# EAGLE design rfid_ctl3 (EAGLE 7.5.0)
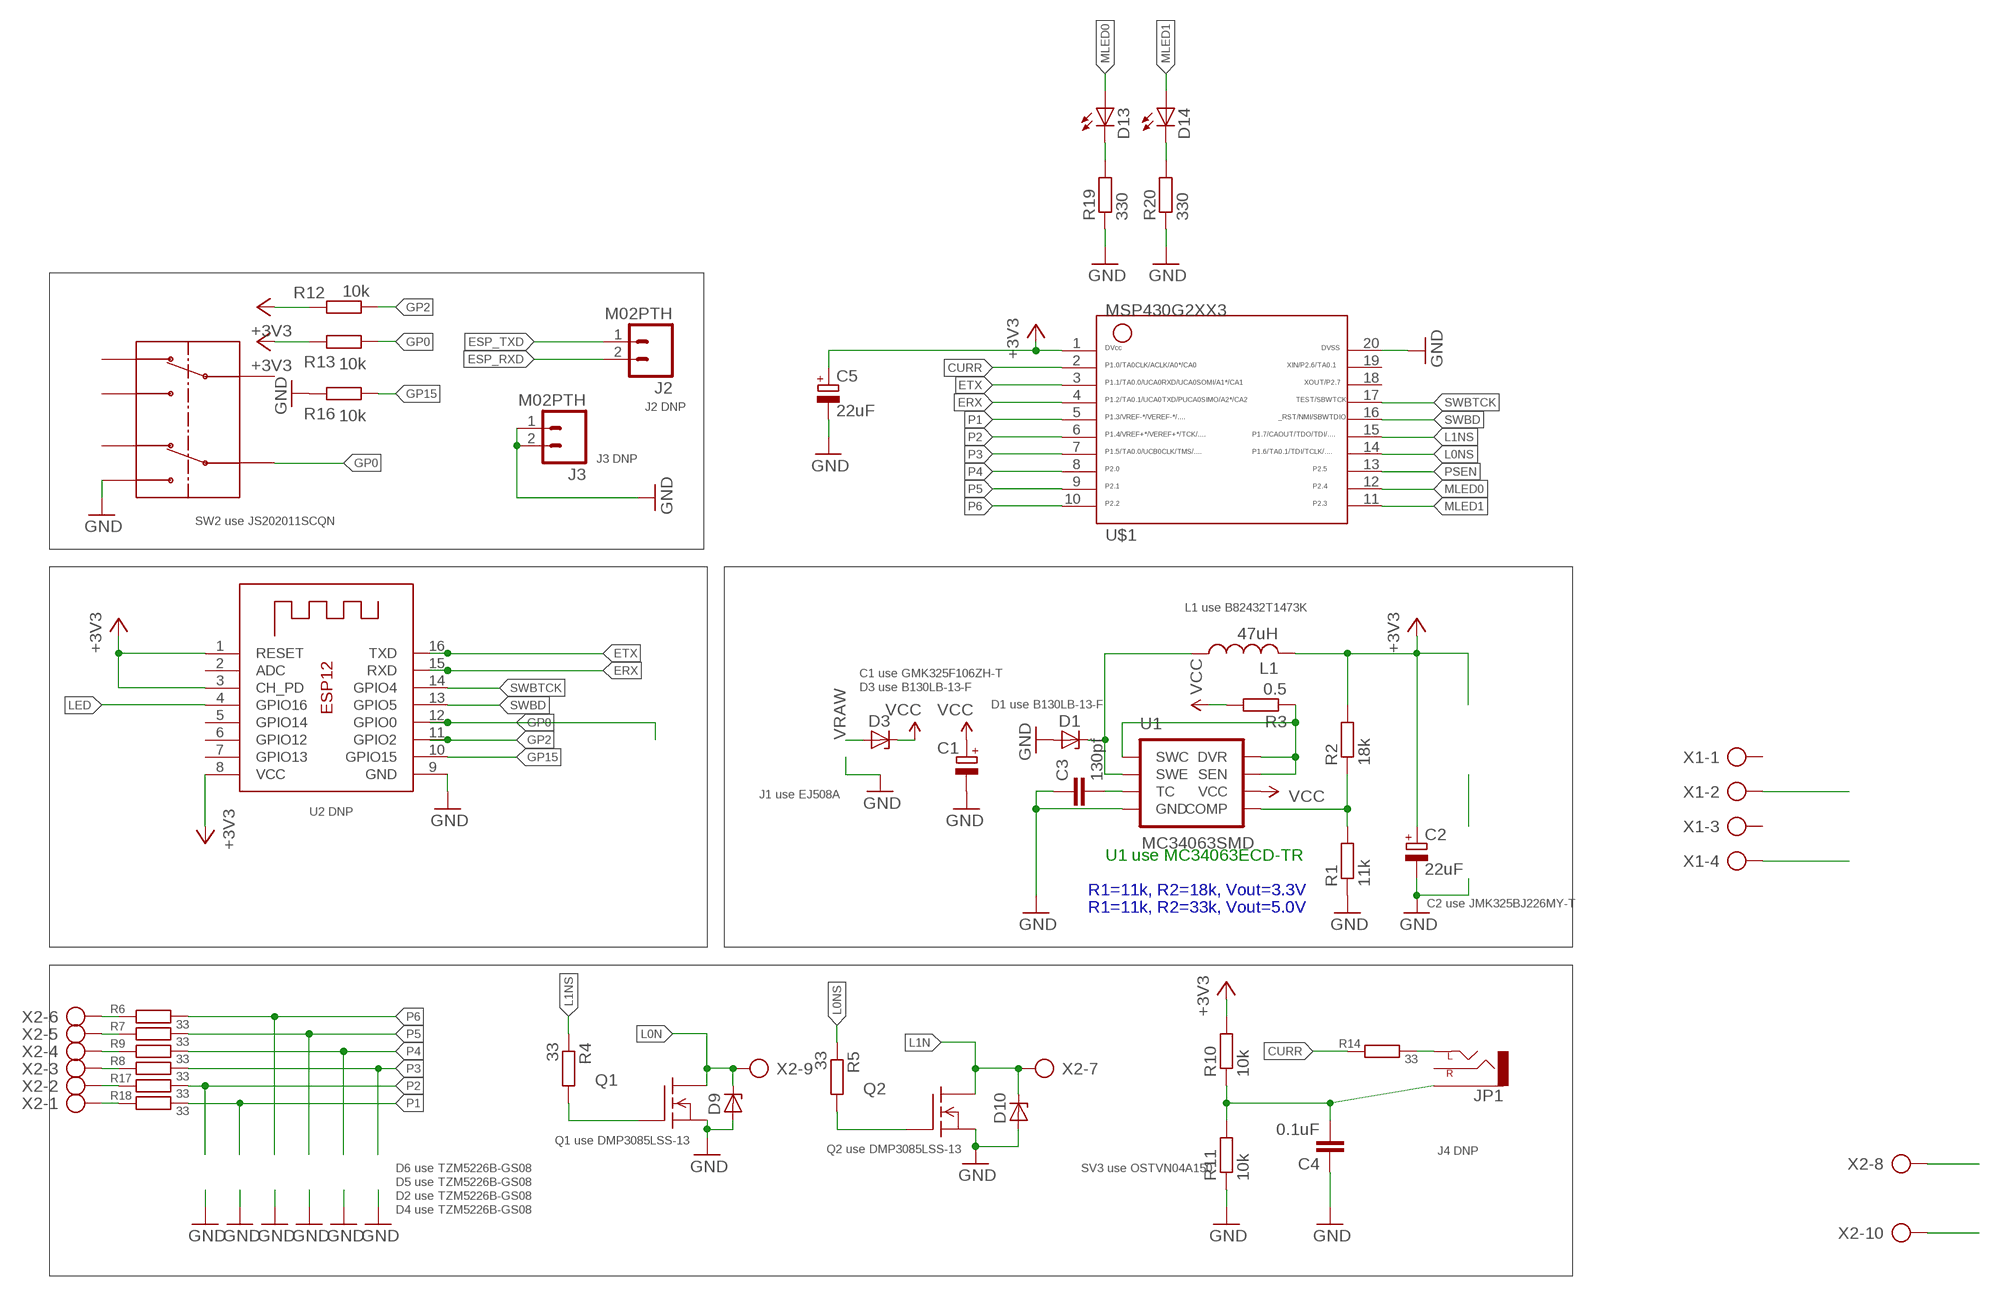
[diagram p0: schematic, sheet 1]

## Parts
C1  CPOL-EUE2.5-7  [E2,5-7]
C2  22uF  CPOL-EUE2.5-7  [E2,5-7]
C3  130pf  C-EUC1206  [C1206]
C4  0.1uF  C-EUC0603  [C0603]
C5  22uF  CPOL-EUE1.8-4  [E1,8-4]
D1  ZENER-DIODESMB  [SMB]
D3  ZENER-DIODESMB  [SMB]
D9  ZENER-DIODESMB  [SMB]
D10  ZENER-DIODESMB  [SMB]
D13  LED5MM  [LED5MM]
D14  LED5MM  [LED5MM]
J2  M02PTH  [1X02]
J3  M02PTH  [1X02]
JP1  AUDIO-JACKSMD2  [AUDIO-JACK-3.5MM-SMD]
L1  47uH  L-USL1812  [L1812]
Q1  FDS5680  [SO-8]
Q2  FDS5680  [SO-8]
R1  11k  R-EU_R1206  [R1206]
R2  18k  R-EU_R1206  [R1206]
R3  0.5  R-EU_R1206  [R1206]
R4  33  R-EU_R1206  [R1206]
R5  33  R-EU_R1206  [R1206]
R6  33  R-EU_R1206  [R1206]
R7  33  R-EU_R1206  [R1206]
R8  33  R-EU_R1206  [R1206]
R9  33  R-EU_R1206  [R1206]
R10  10k  R-EU_R0603  [R0603]
R11  10k  R-EU_R0603  [R0603]
R12  10k  R-EU_R1206  [R1206]
R13  10k  R-EU_R1206  [R1206]
R14  33  R-EU_R1206  [R1206]
R16  10k  R-EU_R0603  [R0603]
R17  33  R-EU_R1206  [R1206]
R18  33  R-EU_R1206  [R1206]
R19  330  R-EU_R0805  [R0805]
R20  330  R-EU_R0805  [R0805]
SW2  L202011MS02Q  [SMT]
U1  MC34063SMD  [SO08]
U2  ESP-12  [ESP-12]
U$1  G2XX3---N20  [N20]
X1  AK300/4  [AK300/4]
X2  AK300/10  [AK300/10]

## Nets
+3V3: C2.+ C5.+ L1.2 R2.2 R10.2 R12.2 R13.2 U2.1(RESET) U2.3(CH_PD) U2.8(VCC) U$1.1
CURR: R14.1 U$1.2
ERX: U2.15(RXD) U$1.4
ESP_RXD: J2.2
ESP_TXD: J2.1
ETX: U2.16(TXD) U$1.3
GND: C1.- C2.- C3.1 C4.1 C5.- D1.A D9.A D10.A J3.1 J3.2 Q1.1(S) Q1.2(S) Q1.3(S) Q2.1(S) Q2.2(S) Q2.3(S) R1.1 R11.1 R16.2 R19.1 R20.1 SW2.B1 U1.4(GND) U2.9(GND) U$1.20
GP0: R13.1 SW2.B U2.12(GPIO0)
GP2: R12.1 U2.11(GPIO2)
GP15: R16.1 U2.10(GPIO15)
L0N: D9.C Q1.5(D) Q1.6(D) Q1.7(D) Q1.8(D) X2.9
L0NS: R5.1 U$1.14
L1N: D10.C Q2.5(D) Q2.6(D) Q2.7(D) Q2.8(D) X2.7
L1NS: R4.1 U$1.15
LED: U2.4(GPIO16)
MLED0: D13.A U$1.12
MLED1: D14.A U$1.11
N$1: Q1.4(G) R4.2
N$2: C3.2 U1.3(TC)
N$3: D1.C L1.1 U1.2(SWE)
N$4: Q2.4(G) R5.2
N$5: R1.2 R2.1 U1.5(COMP)
N$6: R3.1 U1.1(SWC) U1.7(SEN) U1.8(DVR)
N$8: R6.1 X2.6
N$9: R7.1 X2.5
N$10: R8.1 X2.4
N$11: R9.1 X2.3
N$12: C4.2 JP1.SLEEVE R10.1 R11.2
N$14: JP1.TIP(LEFT) R14.2
N$15: D13.K(C) R19.2
N$16: D14.K(C) R20.2
N$17: R17.1 X2.2
N$18: R18.1 X2.1
P1: R18.2 U$1.5
P2: R17.2 U$1.6
P3: R9.2 U$1.7
P4: R8.2 U$1.8
P5: R7.2 U$1.9
P6: R6.2 U$1.10
PSEN: U$1.13
SWBD: U2.13(GPIO5) U$1.16
SWBTCK: U2.14(GPIO4) U$1.17
VCC: C1.+ D3.C R3.2 U1.6(VCC)
VRAW: D3.A X1.2 X1.4 X2.8 X2.10
Unconnected: JP1.RING(RIGHT) SW2.A SW2.A1 SW2.A2 SW2.B2 U2.2(ADC) U2.5(GPIO14) U2.6(GPIO12) U2.7(GPIO13) U$1.18 U$1.19 X1.1 X1.3

## Notes on the sheet
- J2 DNP
- J3 DNP
- SW2 use JS202011SCQN
- L1 use B82432T1473K
- C1 use GMK325F106ZH-T
- D3 use B130LB-13-F
- D1 use B130LB-13-F
- J1 use EJ508A
- U2 DNP
- U1 use MC34063ECD-TR
- R1=11k, R2=18k, Vout=3.3V
- C2 use JMK325BJ226MY-T
- R1=11k, R2=33k, Vout=5.0V
- Q1 use DMP3085LSS-13
- Q2 use DMP3085LSS-13 | J4 DNP
- D6 use TZM5226B-GS08 | SV3 use OSTVN04A150
- D5 use TZM5226B-GS08
- D2 use TZM5226B-GS08
- D4 use TZM5226B-GS08

## Library data of the parts
C1 C2 C5 = rcl:CPOL-EU: POLARIZED CAPACITOR, European symbol
C3 C4 = rcl:C-EU: CAPACITOR, European symbol
D1 D3 D9 D10 = diode:ZENER-DIODE: Z-Diode
D13 D14 = adafruit:LED: LED OSRAM: - CHIPLED LG R971, LG N971, LY N971, LG Q971, LY Q971, LO R971, LY R971 LH N974, LH R974 LS Q976, LO Q976, LY Q976 LO Q996 - Hyper CHIPLED LW Q18S LB Q993, LB Q99A, LB R99A - SideLED LS A670, LO A670, LY A670, LG A670, LP A670 LB A673, LV A673, LT A673, LW A673 LH A674 LY A675 LS A676, LA A676, LO A676, LY A676, LW A676 LS A679, LY A679, LG A679 - Hyper Micro SIDELED® LS Y876, LA Y876, LO Y876, LY Y876 LT Y87S - SmartLED LW L88C, LW L88S LB L89C, LB L89S, LG L890 LS L89K, LO L89K, LY L89K LS L896, LA L896, LO L896, LY L896 - TOPLED LS T670, LO T670, LY T670, LG T670, LP T670 LSG T670, LSP T670, LSY T670, LOP T670, LYG T670 LG T671, LOG T671, LSG T671 LB T673, LV T673, LT T673, LW T673 LH T674 LS T676, LA T676, LO T676, LY T676, LB T676, LH T676, LSB T676, LW T676 LB T67C, LV T67C, LT T67C, LS T67K, LO T67K, LY T67K, LW E67C LS E67B, LA E67B, LO E67B, LY E67B, LB E67C, LV E67C, LT E67C LW T67C LS T679, LY T679, LG T679 LS T770, LO T770, LY T770, LG T770, LP T770 LB T773, LV T773, LT T773, LW T773 LH T774 LS E675, LA E675, LY E675, LS T675 LS T776, LA T776, LO T776, LY T776, LB T776 LHGB T686 LT T68C, LB T68C - Hyper Mini TOPLED® LB M676 - Mini TOPLED Santana® LG M470 LS M47K, LO M47K, LY M47K Source: http://www.osram.convergy.de/
J2 J3 = SparkFun-Connectors:M02: Standard 2-pin 0.1" header. Use with - straight break away headers ( PRT-00116) - right angle break away headers (PRT-00553) - swiss pins (PRT-00743) - machine pins (PRT-00117) - female headers (PRT-00115) Molex polarized connector foot print use with: PRT-08233 with associated crimp pins and housings. 2.54_SCREWTERM for use with PRT-10571. 3.5mm Screw Terminal footprints for PRT-08084 5mm Screw Terminal footprints for use with PRT-08432
JP1 = SparkFun-Connectors:AUDIO-JACK: 3.5mm Audio Jack Simple 3.5mm common PCB mount audio jack. SKU: PRT-08032; PROD_ID: CONN-10353
L1 = rcl:L-US: INDUCTOR, American symbol
Q1 Q2 = transistor-fet:FDS5680: 60V N-Channel PowerTrench TM MOSFET FAIRCHILD FDS5680.pdf
R1-R14 R16-R20 = rcl:R-EU_: RESISTOR, European symbol
SW2 = JS202011SCQNC&K:L202011MS02Q
U1 = SparkFun:MC34063
U2 = adafruit:ESP-12
U$1 = TI_MSP430_v16:G2XX3---N20: MSP430G2XX1 PDIP (N) 20 Pin Package
X1 = con-ptr500:AK300/4: CONNECTOR; OC_FARNELL: unknown; OC_NEWARK: unknown
X2 = con-ptr500:AK300/10: CONNECTOR; OC_FARNELL: unknown; OC_NEWARK: unknown

## Board
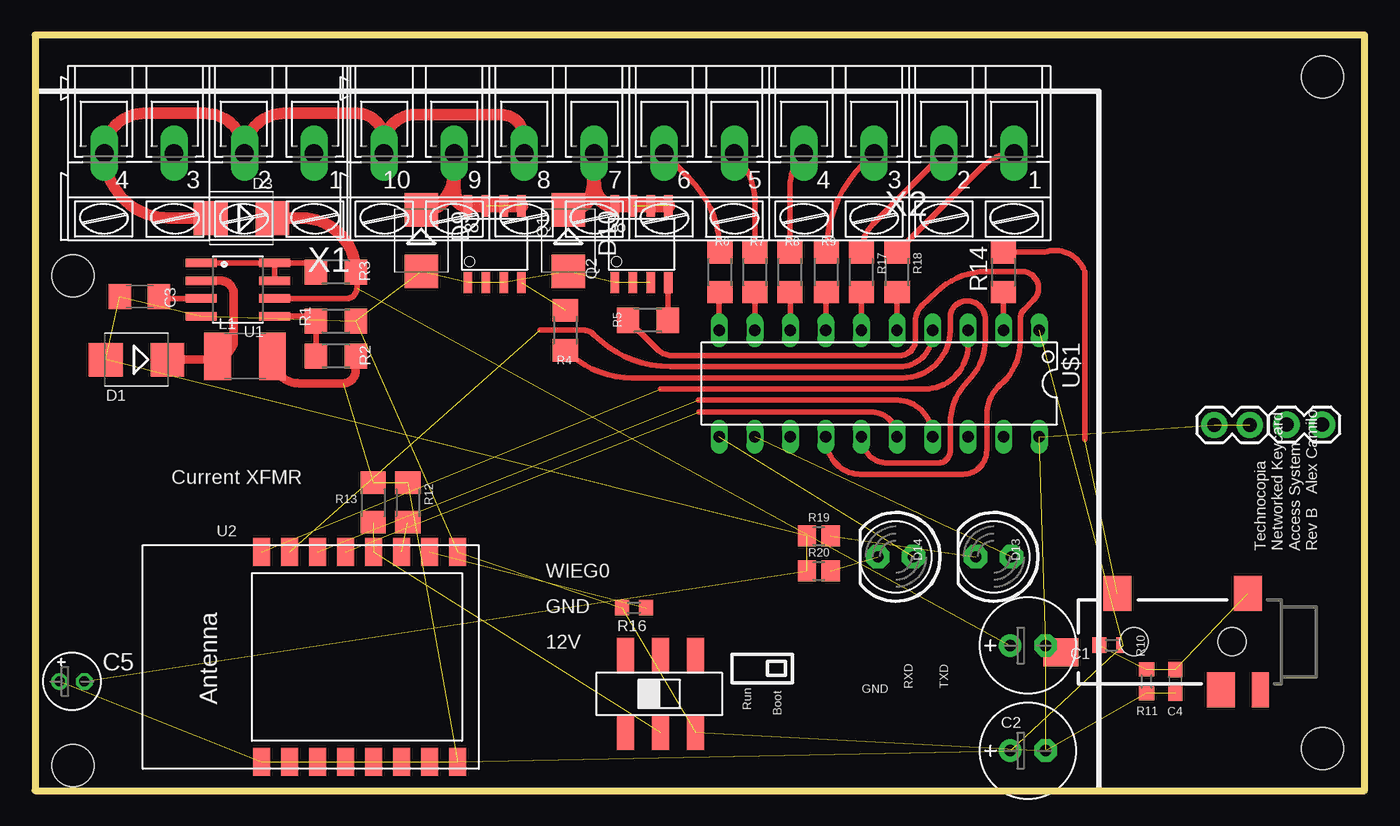
[diagram p1: board, top side]

Size 95 x 54 mm. Coordinates in mm from the lower left corner, seen from the top.
Outline: 0,0 95,0 95,54 0,54 0,0
Copper layers (1*16): Top 0.0356mm / dielectric 1.5011mm / Bottom 0.0356mm
Design rules "LaenPCBOrder *": minimum track width 6mil, minimum drill 13mil, track to track 6mil, track to pad 6mil, pad to pad 6mil, via to via 6mil, smd to smd 6mil, copper to edge 15mil, drill to drill 6mil, minimum pad ring 7mil, minimum via ring 7mil, stop-mask expansion 3mil, vias tented up to drill 30mil, thermal gap 10mil
Holes 3 mm at 2.7,36.8 92,51 92,3 2.7,1.8

### Footprints (pad centres in the part's own frame; a part is rotated, then mirrored left to right if it is on the bottom)
E2,5-7 = drill 0.813 pad 1.6: + -1.27,0 | drill 0.813 pad 1.6 octagon: - 1.27,0
C1206 = smd 1.6 x 1.8: 1 -1.4,0; 2 1.4,0
C0603 = smd 1.1 x 1: 1 -0.85,0; 2 0.85,0
E1,8-4 = drill 0.711 pad 1.168: + -0.889,0 | drill 0.711 pad 1.168 octagon: - 0.889,0
SMB = smd 2.4 x 2.4: A 2.2,0; C -2.2,0
LED5MM = drill 0.813 pad 1.676 octagon: A -1.27,0; K 1.27,0
1X02 = drill 1.016 pad 1.88: 1 0,0; 2 2.54,0
AUDIO-JACK-3.5MM-SMD = smd 2 x 2.5: RING 4.3,3.45; SLEEVE 2.4,-3.45; TIP 11.7,-3.45 | smd 1.2 x 2.5: RSH 1.5,3.45 | smd 2.5 x 2: TSH 15.75,0.75 | hole 2: 3.5,0; 10.5,0
L1812 = smd 1.9 x 3.4: 1 -1.95,0; 2 1.95,0
SO-8 = smd 1.524 x 0.61: 1 -2.743,1.905; 2 -2.743,0.635; 3 -2.743,-0.635; 4 -2.743,-1.905; 5 2.743,-1.905; 6 2.743,-0.635; 7 2.743,0.635; 8 2.743,1.905
R1206 = smd 1.6 x 1.803: 1 -1.422,0; 2 1.422,0
R0603 = smd 1 x 1.1: 1 -0.85,0; 2 0.85,0
R0805 = smd 1.3 x 1.5: 1 -0.85,0; 2 0.85,0
SMT = smd 1.2 x 2.5: A 3.1,1.3; A1 0.6,1.3; A2 5.6,1.3; B 3.1,6.8; B1 0.6,6.8; B2 5.6,6.8
SO08 = smd 0.61 x 2.21: 1 -1.905,-2.616; 2 -0.635,-2.616; 3 0.635,-2.616; 4 1.905,-2.616; 5 1.905,2.616; 6 0.635,2.616; 7 -0.635,2.616; 8 -1.905,2.616
ESP-12 = smd 2 x 1.2: 1 -7.5,4.5; 2 -7.5,2.5; 3 -7.5,0.5; 4 -7.5,-1.5; 5 -7.5,-3.5; 6 -7.5,-5.5; 7 -7.5,-7.5; 8 -7.5,-9.5; 9 7.5,-9.5; 10 7.5,-7.5; 11 7.5,-5.5; 12 7.5,-3.5; 13 7.5,-1.5; 14 7.5,0.5; 15 7.5,2.5; 16 7.5,4.5
N20 = drill 0.813 long: 1 -11.435,-3.81; 2 -8.895,-3.81; 3 -6.355,-3.81; 4 -3.815,-3.81; 5 -1.275,-3.81; 6 1.265,-3.81; 7 3.805,-3.81; 8 6.345,-3.81; 9 8.885,-3.81; 10 11.425,-3.81; 11 11.425,3.81; 12 8.885,3.81; 13 6.345,3.81; 14 3.805,3.81; 15 1.265,3.81; 16 -1.275,3.81; 17 -3.815,3.81; 18 -6.355,3.81; 19 -8.895,3.81; 20 -11.435,3.81
AK300/4 = drill 1.321 long: 1 -7.493,0; 2 -2.515,0; 3 2.515,0; 4 7.493,0
AK300/10 = drill 1.321 long: 1 -22.504,0; 2 -17.501,0; 3 -12.497,0; 4 -7.493,0; 5 -2.515,0; 6 2.489,0; 7 7.493,0; 8 12.497,0; 9 17.501,0; 10 22.504,0

### Placement (x,y rotation side)
C1  70.94,10.37 0 top
C2  70.95,2.85 0 top
C3  7.47,35.3 0 top
C4  81.47,7.8 90 top
C5  2.64,7.79 0 top
D1  7.25,30.8 180 top
D3  14.75,40.91 180 top
D9  27.6,39.3 270 top
D10  38.1,39.3 270 top
D13  68.5,16.7 180 top
D14  61.5,16.7 180 top
J2  91.97,26.15 180 top
J3  84.27,26.13 0 top
JP1  89.05,10.63 180 top
L1  15,31.05 0 top
Q1  32.85,39.05 90 top
Q2  43.35,39.05 90 top
R1  21.5,33.55 180 top
R2  21.5,31.05 0 top
R3  21.5,37.05 0 top
R4  37.9,32.9 90 top
R5  43.8,33.6 0 top
R6  48.95,37.05 270 top
R7  51.45,37.05 270 top
R8  53.95,37.05 270 top
R9  56.55,37.05 270 top
R10  76.92,10.38 0 top
R11  79.42,7.8 90 top
R12  26.64,20.59 90 top
R13  24.15,20.59 90 top
R14  69.2,37.05 90 top
R16  42.8,13.06 180 top
R17  59.05,37.05 270 top
R18  61.6,37.05 270 top
R19  56,18.2 0 top
R20  56,15.7 0 top
SW2  47.8,10.96 180 top
U1  14.5,35.8 270 top
U2  20.7,9.55 90 top
U$1  60.32,29.09 180 top
X1  12.45,45.55 180 top
X2  47.45,45.55 180 top

### Tracks (layer width: path | path; a pad name or v marks a point on that pad's centre or on a via)
+3V3  (9 unrouted)
  Top 0.61: R2.2 22.92,30.02 arc-90 22,29.1 18.9,29.1 arc-90 L1.2
CURR
  Top 0.406: R14.1 69.2,32.91 arc90 U$1.2
ERX  (1 unrouted)
  Top 0.406: U$1.4 64.13,32.63 arc-90 61.8,30.3 45.4,30.3 arc-45 39.94,32.56 39.9,32.6 arc45 39.18,32.9 36.1,32.9
ETX  (1 unrouted)
  Top 0.406: U$1.3 66.67,31.82 arc-90 63.55,28.7 44.7,28.7
GND  (24 unrouted)
GP0  (2 unrouted)
GP2  (1 unrouted)
GP15  (1 unrouted)
L0N  (2 unrouted)
  Top 1.016: Q1.5 Q1.8 arc-90 29.95,42.79 X2.9 29.95,43.85 arc-90 D9.C
L0NS
  Top 0.406: U$1.14 56.51,25.21 arc45 57.3,23.3 arc45 58.99,22.6 66.3,22.6 arc90 68,24.3 68,26.8 arc-53 69.2,29.2 arc45 70.4,32.1 70.4,33.7 arc-45 70.68,34.38 71.35,35.05 arc45 71.7,35.9 arc90 70.5,37.1 68,37.1 arc45 64.42,35.62 63.4,34.7 arc45 62.9,33.42 62.9,32.2 arc-90 61.8,31.1 45.5,31.1 arc-45 44.48,31.52 43.2,32.8 arc-45 43.16,32.82 R5.1
L1N  (2 unrouted)
  Top 1.016: Q2.5 Q2.8 arc-90 39.96,43.28 X2.7 39.96,43.36 arc-90 D10.C
L1NS
  Top 0.406: U$1.15 arc90 60.93,23.4 64.5,23.4 arc90 65.4,24.3 65.4,26.2 arc-45 66.67,29.27 arc45 67.9,32.24 67.9,33.7 arc90 66.6,35 arc90 65.4,33.8 65.4,32.9 arc-90 62,29.5 42.67,29.5 arc-45 R4.1
MLED0  (1 unrouted)
MLED1  (1 unrouted)
N$1  (1 unrouted)
N$2
  Top 0.406: U1.3 9.01,35.16 arc-90 C3.2
N$3
  Top 0.61: U1.2 13.27,36.44 arc-90 14.2,35.5 14.2,32.2 arc-90 L1.1 arc-90 12.8,30.8 D1.C
N$4
  Top 0.406: R5.2 45.22,36.23 arc-45 Q2.4
N$5
  Top 0.406: U1.5 19.73,33.9 arc-90 R1.2 R2.1
N$6
  Top 0.406: U1.8 19.42,37.7 arc-90 R3.1 | U1.7 U1.8 | U1.1 U1.8
N$8
  Top 0.406: X2.6 46.77,43.74 arc-45 R6.1
N$9
  Top 0.406: X2.5 arc-45 51.45,41.96 R7.1
N$10
  Top 0.406: X2.4 arc45 53.95,43.15 R8.1
N$11
  Top 0.406: X2.3 59.15,44.76 arc45 R9.1
N$12  (3 unrouted)
N$14  (1 unrouted)
  Top 0.406: R14.2 72.13,38.47 arc-90 75,37.1 75,25.1
N$15  (1 unrouted)
N$16  (1 unrouted)
N$17
  Top 0.406: X2.2 59.88,40.48 arc45 R17.1
N$18
  Top 0.406: R18.1 67.78,44.65 arc-45 X2.1
P1
  Top 0.406: R18.2 61.59,35.62 U$1.5
P2
  Top 0.406: R17.2 | R17.2 U$1.6
P3
  Top 0.406: R9.2 56.51,35.59 U$1.7
P4
  Top 0.406: R8.2 53.97,35.61 U$1.8
P5
  Top 0.406: R7.2 51.43,35.61 U$1.9
P6
  Top 0.406: R6.2 48.89,35.57 U$1.10
SWBD  (1 unrouted)
  Top 0.406: 47.45,27.05 59.72,27.05 arc-90 U$1.16
SWBTCK  (1 unrouted)
  Top 0.406: 47.4,27.9 61.61,27.9 arc-90 U$1.17
VCC  (1 unrouted)
  Top 0.406: U1.6 22.27,35.16 arc90 23,35.9 23,36.97 arc90 R3.2
  Top 0.813: D3.C 19.06,40.91 arc-90 R3.2
VRAW
  Top 0.813: D3.A 9.6,40.91 arc-90 X1.4 arc-90 7.81,48.4 12.12,48.4 arc-90 X1.2 arc-90 17.82,48.4 23,48.4 arc-90 24.95,46.45 24.95,46.1 | 24.95,46.1 X2.10 | X2.8 34.95,46.65 arc90 33.3,48.3 27.15,48.3 arc90 24.95,46.1

### Text on the board
tPlace: Current XFMR | Technocopia / Networked Keycard / Access System / Rev B Alex Camilo | WIEG0 | GND | 12V | GND | RXD | TXD | Run | Boot